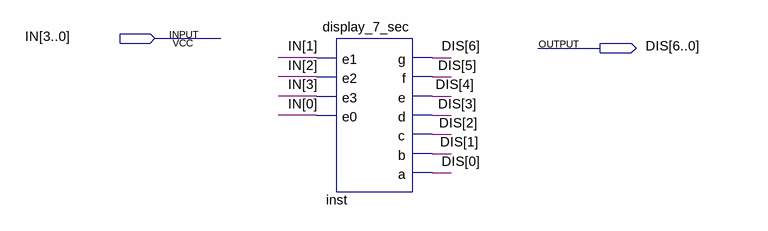
[diagram p0: schematic sheet]
// Quartus schematic display_bus.bdf as structural Verilog: 1 symbols, 2 pins
module display_bus (
  input  [3:0] IN,
  output [6:0] DIS
);

  display_7_sec inst (
    .e1(IN[1]), .e2(IN[2]), .e3(IN[3]), .e0(IN[0]), .g(DIS[6]), .f(DIS[5]), .e(DIS[4]), .d(DIS[3]),
    .c(DIS[2]), .b(DIS[1]), .a(DIS[0]));
endmodule
